# EAGLE design AVR8-pin (EAGLE 7.5.0)
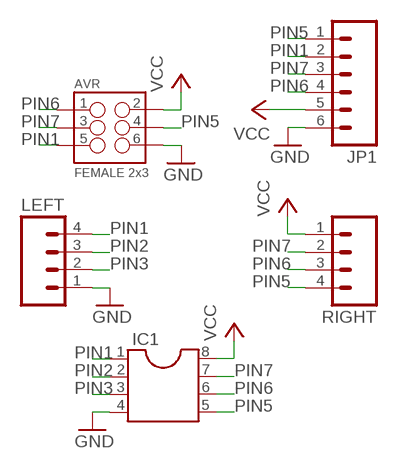
[diagram p0: schematic, sheet 1]

## Parts
AVR  FEMALE 2x3  M03X2FEMALE  [2X3]
IC1  DIL8  [DIL08]
JP1  M06SILK_FEMALE_PTH  [1X06]
LEFT  M04PTH  [1X04]
RIGHT  M04PTH  [1X04]

## Nets
GND: AVR.6 IC1.4 JP1.6 LEFT.1
PIN1: AVR.5 IC1.1 JP1.2 LEFT.4
PIN2: IC1.2 LEFT.3
PIN3: IC1.3 LEFT.2
PIN5: AVR.4 IC1.5 JP1.1 RIGHT.4
PIN6: AVR.1 IC1.6 JP1.4 RIGHT.3
PIN7: AVR.3 IC1.7 JP1.3 RIGHT.2
VCC: AVR.2 IC1.8 JP1.5 RIGHT.1

## Library data of the parts
AVR = SparkFun-Connectors:M03X2: 2x3 .1" header. Shrouded, with keying- CONN-10681 SMT- CONN-11415 Pogo pins- HW-11044; PROD_ID: CONN-11566
IC1 = ic-package:DIL8: Dual In Line / Socket
JP1 = SparkFun-Connectors:M06: Header 6 Standard 6-pin 0.1" header. Use with straight break away headers (SKU : PRT-00116), right angle break away headers (PRT-00553), swiss pins (PRT-00743), machine pins (PRT-00117), and female headers (PRT-00115). Molex polarized connector foot print use with SKU : PRT-08094 with associated crimp pins and housings. NOTES ON THE VARIANTS LOCK and LOCK_LONGPADS... This footprint was designed to help hold the alignment of a through-hole component (i.e. 6-pin header) while soldering it into place. You may notice that each hole has been shifted either up or down by 0.005 of an inch from it's more standard position (which is a perfectly straight line). This slight alteration caused the pins (the squares in the middle) to touch the edges of the holes. Because they are alternating, it causes a "brace" to hold the component in place. 0.005 has proven to be the perfect amount of "off-center" position when using our standard breakaway headers. Although looks a little odd when you look at the bare footprint, once you have a header in there, the alteration is very hard to notice. Also,if you push a header all the way into place, it is covered up entirely on the bottom side. This idea of altering the position of holes to aid alignment will be further integrated into the Sparkfun Library for other footprints. It can help hold any component with 3 or more connection pins.; PROD_ID: CONN-08437
LEFT RIGHT = SparkFun-Connectors:M04: Header 4 Standard 4-pin 0.1" header. Use with straight break away headers (SKU : PRT-00116), right angle break away headers (PRT-00553), swiss pins (PRT-00743), machine pins (PRT-00117), and female headers (PRT-00115). Molex polarized connector foot print use with SKU : PRT-08231 with associated crimp pins and housings. 1MM SMD Version SKU: PRT-10208

## Board
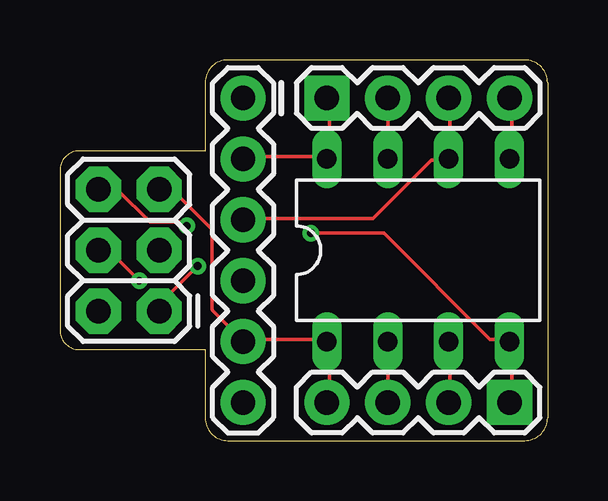
[diagram p1: board, top side]
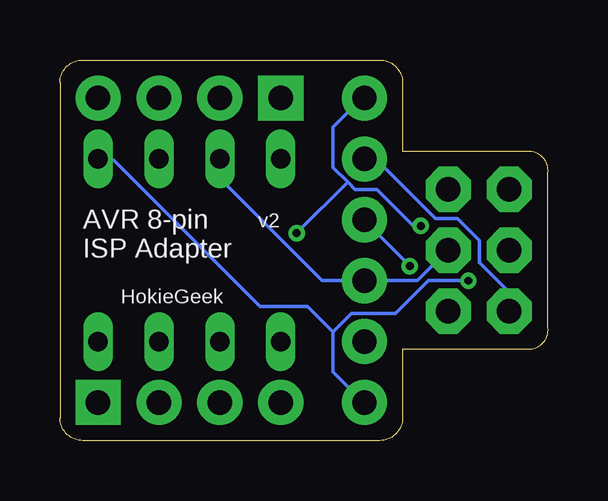
[diagram p2: board, bottom side, seen from below]

Size 20.34 x 15.88 mm. Coordinates in mm from the lower left corner, seen from the top.
Outline: 7,0 19.38,0 arc90 20.34,0.95 20.34,14.92 arc90 19.38,15.88 7,15.88 arc90 6.05,14.92 6.05,12.07 0.65,12.07 arc90 0.02,11.11 0.02,4.76 arc90 0.65,3.81 6.05,3.81 6.05,0.95 arc90 7,0
Copper layers (1*16): Top 0.0356mm / dielectric 1.5011mm / Bottom 0.0356mm
Design rules "LaenPCBOrder": minimum track width 6mil, minimum drill 13mil, track to track 6mil, track to pad 6mil, pad to pad 6mil, via to via 6mil, smd to smd 6mil, copper to edge 15mil, drill to drill 6mil, minimum pad ring 7mil, minimum via ring 7mil, stop-mask expansion 3mil, vias tented up to drill 0mil, thermal gap 10mil

### Footprints (pad centres in the part's own frame; a part is rotated, then mirrored left to right if it is on the bottom)
2X3 = drill 1.016 pad 1.88 octagon: 1 0,0; 2 0,2.54; 3 2.54,0; 4 2.54,2.54; 5 5.08,0; 6 5.08,2.54
DIL08 = drill 0.813 long: 1 -3.81,-3.81; 2 -1.27,-3.81; 3 1.27,-3.81; 4 3.81,-3.81; 5 3.81,3.81; 6 1.27,3.81; 7 -1.27,3.81; 8 -3.81,3.81
1X06 = drill 1.016 pad 1.88: 1 0,0; 2 2.54,0; 3 5.08,0; 4 7.62,0; 5 10.16,0; 6 12.7,0
1X04 = drill 1.016 pad 1.88 square: 1 0,0 | drill 1.016 pad 1.88: 2 2.54,0; 3 5.08,0; 4 7.62,0

### Placement (x,y rotation side)
AVR  4.14,5.4 90 top
IC1  14.94,7.94 0 top
JP1  7.64,1.59 90 top
LEFT  18.75,1.59 180 top
RIGHT  11.13,14.29 0 top

### Tracks (layer width: path | path; a pad name or v marks a point on that pad's centre or on a via)
GND  (via drill 0.33)
  Top 0.152: LEFT.1 18.85,1.64 18.85,4.08 IC1.4 18.7,4.23 17.94,4.23 13.52,8.65 v10.47,8.65 | AVR.6 2.39,10.48 3.76,9.11 5.13,9.11 v5.29,8.95
  Bottom 0.152: v5.29,8.95 5.59,8.95 7.12,10.48 8.03,10.48 8.33,10.78 | 8.33,10.78 8.94,11.39 8.94,13.07 7.72,14.29 JP1.6 | 8.33,10.78 v10.47,8.65
PIN1
  Top 0.152: LEFT.4 11.23,1.64 11.23,4.08 IC1.1 11.08,4.23 7.72,4.23 JP1.2 7.57,4.23 6.35,5.45 6.35,8.8 4.68,10.48 AVR.5
PIN2
  Top 0.152: LEFT.3 IC1.2
PIN3
  Top 0.152: IC1.3 16.26,4.08 16.26,1.64 LEFT.2
PIN5  (via drill 0.33)
  Top 0.152: IC1.5 18.85,11.85 18.85,14.29 RIGHT.4 | v3.31,6.67 2.09,7.89 1.63,7.89 AVR.4
  Bottom 0.152: v3.31,6.67 4.98,6.67 6.35,5.3 8.18,5.3 8.94,4.53 | 8.94,4.53 8.94,2.86 7.72,1.64 JP1.1 | 8.94,4.53 10.01,5.6 11.99,5.6 18.09,11.7 18.7,11.7 IC1.5
PIN6  (via drill 0.33)
  Top 0.152: RIGHT.3 16.26,14.29 16.26,11.85 IC1.6 16.11,11.7 15.5,11.7 13.06,9.26 7.72,9.26 JP1.4 | v5.74,7.28 4.22,5.75 4.22,5.45 AVR.1
  Bottom 0.152: v5.74,7.28 7.57,9.11 JP1.4
PIN7
  Top 0.152: RIGHT.2 IC1.7
  Bottom 0.152: AVR.3 4.22,7.89 5.44,6.67 JP1.3 9.4,6.67 13.67,10.93 IC1.7
VCC
  Top 0.152: RIGHT.1 11.23,14.29 11.23,11.85 IC1.8 11.08,11.85 7.72,11.85 JP1.5
  Bottom 0.152: AVR.2 1.63,5.45 1.63,6.21 2.85,7.43 2.85,8.34 3.76,9.26 4.68,9.26 7.12,11.7 7.57,11.7 JP1.5

### Text on the board
bPlace: v2 | AVR 8-pin / ISP Adapter | HokieGeek